# EAGLE schematic Heat_monitor (EAGLE 9.6.2)
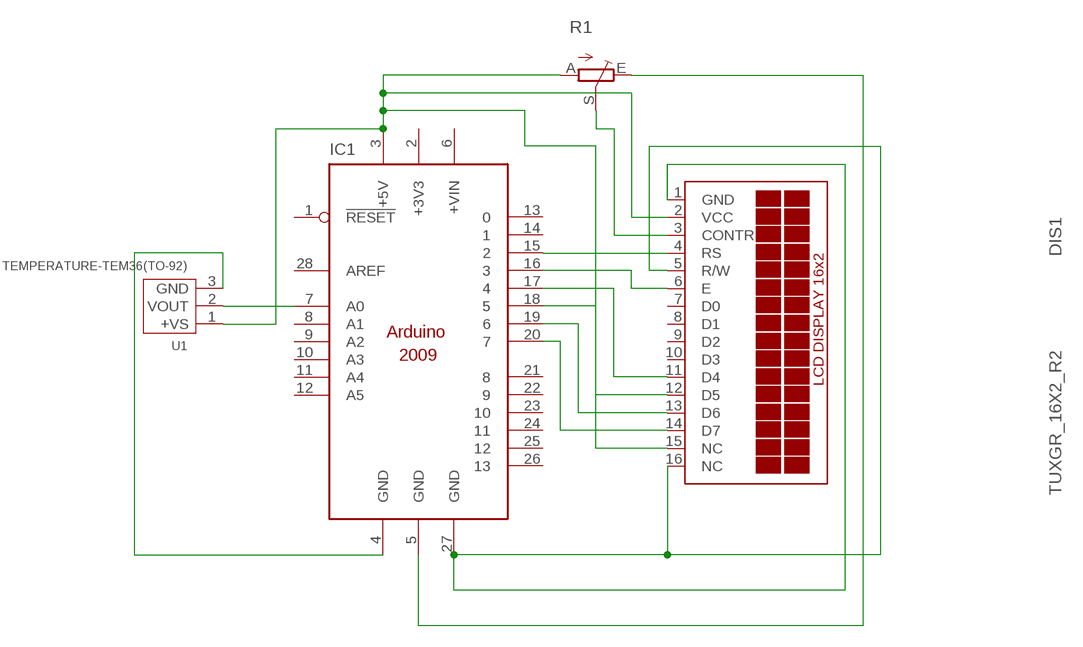
[diagram p0: schematic, sheet 1]

## Parts
DIS1  TUXGR_16X2_R2  [TUXGR_16X2_R2]
IC1  ARDUINO2009_10  [ARDUINO2009]
R1  TRIM_EU-B25U  [B25U]
U1  TEMPERATURE-TEM36(TO-92)  [TO-92-3]

## Nets
N$1: DIS1.11(D4) IC1.17
N$2: DIS1.2(VCC) DIS1.15(NC) IC1.3(+5V) R1.A U1.1(+VS)
N$3: IC1.5(GND) R1.E
N$4: IC1.4(GND) U1.3(GND)
N$5: IC1.7(A0) U1.2(VOUT)
N$6: DIS1.12(D5) IC1.18
N$7: DIS1.1(GND) DIS1.5(R/W) DIS1.16(NC) IC1.27(GND)
N$8: DIS1.3(CONTR) R1.S
N$9: DIS1.4(RS) IC1.15
N$10: DIS1.6(E) IC1.16
N$11: DIS1.13(D6) IC1.19
N$12: DIS1.14(D7) IC1.20
Unconnected: DIS1.7(D0) DIS1.8(D1) DIS1.9(D2) DIS1.10(D3) IC1.1(!RESET) IC1.6(+VIN) IC1.8(A1) IC1.9(A2) IC1.10(A3) IC1.11(A4) IC1.12(A5) IC1.13 IC1.14 IC1.21 IC1.22 IC1.23 IC1.24 IC1.25 IC1.26 IC1.28(AREF)

## Power pins joined to a net without a drawn wire
+3V3: IC1.2(+3V3)

## Library data of the parts
DIS1 = display-lcd:TUXGR_16X2_R2: Tuxgraphics LCD display 16x2 characters reflective, without background light Source: tuxgr_12x2_r2.pdf; OC_FARNELL: unknown; OC_NEWARK: unknown
IC1 = arduino:ARDUINO2009_1: The Arduino Duemilanove ("2009") is a microcontroller board based on the ATmega168 or ATmega328. - 14 digital input/output pins (of which 6 can be used as PWM outputs) - 6 analog inputs, a 16 MHz crystal oscillator - USB connection - power jack - ISP header - reset button It contains everything needed to support the microcontroller; simply connect it to a computer with a USB cable or power it with a AC-to-DC adapter or battery to get started http://arduino.cc/en/Main/ArduinoBoardDuemilanove
R1 = pot:TRIM_EU-: POTENTIOMETER
U1 = TEMPERATURE-TEM36_TO-92_:TEMPERATURE-TEM36(TO-92): 314010011 Check prices <https://pricing.snapeda.com/parts/TMP36/Analog%20Devices/view-part?ref=eda>; AVAILABILITY: Bad; DESCRIPTION: Temperature Sensor Analog, Local -40°C ~ 125°C 10mV/°C 8-SOIC; MF: Analog Devices; MP: TMP36; PACKAGE: SOT-23-5 Analog Devices; PRICE: None